# EAGLE design bioamplifierarduinoCMS (EAGLE 7.7.0)
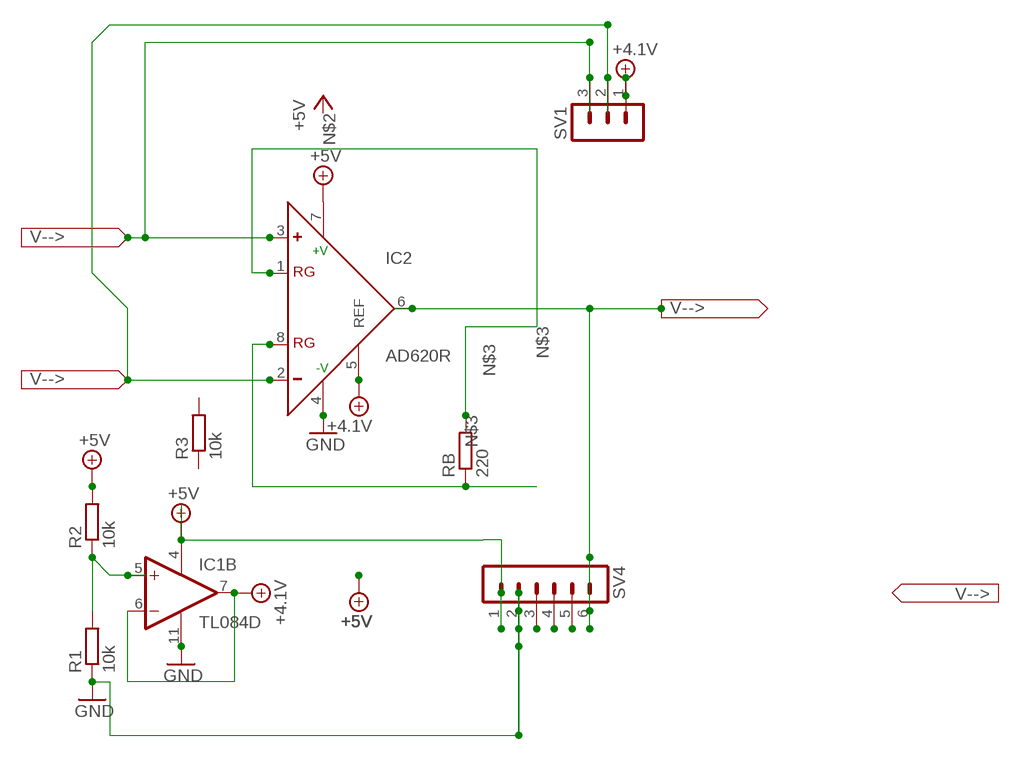
[diagram p0: schematic, sheet 1]

## Parts
IC1  TL084D  [SO14]
IC2  AD620R  [SO8]
R1  10k  R-EU_R1206  [R1206]
R2  10k  R-EU_R1206  [R1206]
R3  10k  R-EU_R1206  [R1206]
RB  220  R-EU_R1206  [R1206]
SV1  MA03-1  [MA03-1]
SV4  MA06-1  [MA06-1]

## Nets
+4.1V: IC1.6(B:-IN) IC1.7(B:OUT) IC2.5(REF)
+5V: IC1.4(P:V+) R2.2 SV4.1
GND: IC1.11(P:V-) IC2.4(-V) R1.1 SV4.2
N$1: IC2.3(+) SV1.3
N$2: IC2.7(+V) ; supply symbol labelled +5V
N$3: IC2.1(RG) RB.2
N$4: IC1.5(B:+IN) R1.2 R2.1
N$5: IC2.6(OUT) SV4.6
N$7: SV4.3
N$8: SV4.4
N$9: SV4.5
N$10: IC2.2(-) SV1.2
N$11: IC2.8(RG) RB.1
N$15: SV1.1
Unconnected: IC1.1(A:OUT) IC1.2(A:-IN) IC1.3(A:+IN) IC1.8(C:OUT) IC1.9(C:-IN) IC1.10(C:+IN) IC1.12(D:+IN) IC1.13(D:-IN) IC1.14(D:OUT) R3.1 R3.2

## Library data of the parts
IC1 = linear:TL084: OP AMP
IC2 = analog-devices:AD620: Low Cost, Low Power, Instrumentation Amplifier Source: http://www.analog.com/UploadedFiles/Data_Sheets/37793330023930AD620_e.pdf; MPN: AD620AR; OC_FARNELL: 1464424; OC_NEWARK: 05F7109
R1-R3 RB = resistor:R-EU_: RESISTOR, European symbol
SV1 = con-lstb:MA03-1: PIN HEADER; OC_FARNELL: unknown; OC_NEWARK: unknown
SV4 = con-lstb:MA06-1: PIN HEADER; OC_FARNELL: unknown; OC_NEWARK: unknown

## Board
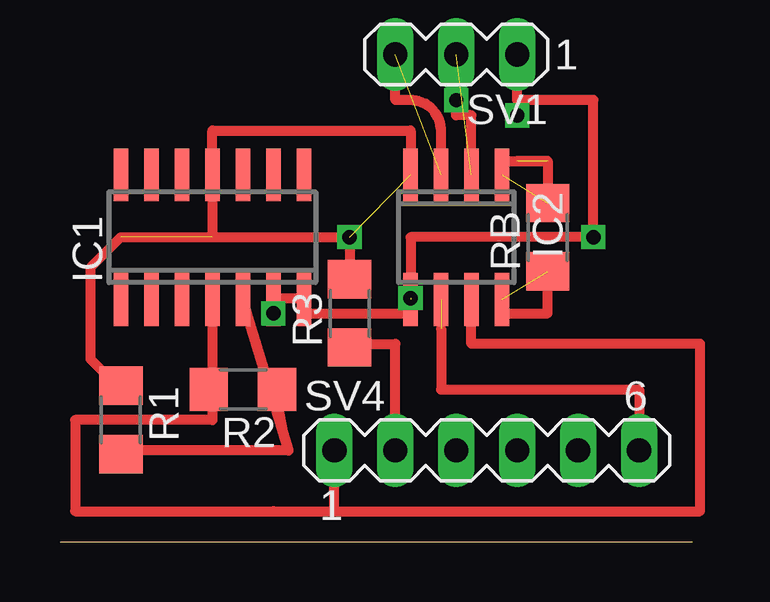
[diagram p1: board, top side]
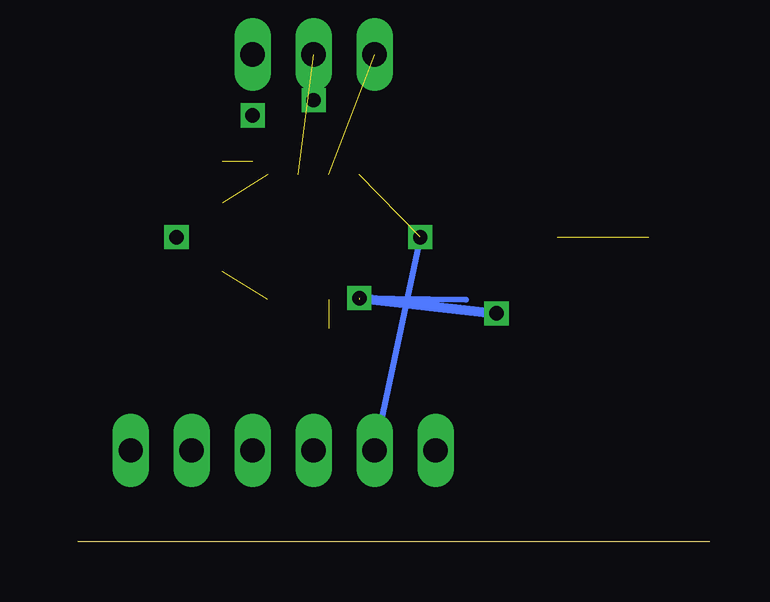
[diagram p2: board, bottom side, seen from below]

Size 26.34 x 0 mm. Coordinates in mm from the lower left corner, seen from the top.
Outline: 0,0 26.34,0
Copper layers (1*16): Top 0.035mm / dielectric 1.5mm / Bottom 0.035mm
Design rules "default": minimum track width 10mil, minimum drill 24mil, track to track 8mil, track to pad 8mil, pad to pad 8mil, via to via 8mil, smd to smd 8mil, copper to edge 40mil, drill to drill 8mil, minimum pad ring 10mil, minimum via ring 8mil, stop-mask expansion 4mil, vias tented up to drill 0mil, thermal gap 10mil

### Footprints (pad centres in the part's own frame; a part is rotated, then mirrored left to right if it is on the bottom)
SO14 = smd 0.6 x 2.2: 1 -3.81,-2.6; 2 -2.54,-2.6; 3 -1.27,-2.6; 4 0,-2.6; 5 1.27,-2.6; 6 2.54,-2.6; 7 3.81,-2.6; 8 3.81,2.6; 9 2.54,2.6; 10 1.27,2.6; 11 0,2.6; 12 -1.27,2.6; 13 -2.54,2.6; 14 -3.81,2.6
SO8 = smd 0.6 x 2.2: 1 -1.905,-2.6; 2 -0.635,-2.6; 3 0.635,-2.6; 4 1.905,-2.6; 5 1.905,2.6; 6 0.635,2.6; 7 -0.635,2.6; 8 -1.905,2.6
R1206 = smd 1.6 x 1.803: 1 -1.422,0; 2 1.422,0
MA03-1 = drill 1.016 long: 1 -2.54,0; 2 0,0; 3 2.54,0
MA06-1 = drill 1.016 long: 1 -6.35,0; 2 -3.81,0; 3 -1.27,0; 4 1.27,0; 5 3.81,0; 6 6.35,0

### Placement (x,y rotation side)
IC1  6.35,12.7 0 top  (outside the outline)
IC2  16.51,12.7 180 top  (outside the outline)
R1  2.54,5.08 270 top  (outside the outline)
R2  7.62,6.35 180 top  (outside the outline)
R3  12.06,9.53 90 top  (outside the outline)
RB  20.32,12.7 90 top  (outside the outline)
SV1  16.51,20.32 180 top  (outside the outline)
SV4  17.78,3.81 0 top  (outside the outline)

### Tracks (layer width: path | path; a pad name or v marks a point on that pad's centre or on a via)
+4.1V  (via drill 0.6)  (2 unrouted)
  Top 0.254: v8.89,9.53 IC1.6
  Top 0.406: v14.61,10.16 14.61,12.7 v22.22,12.7
  Bottom 0.254: v14.61,10.16 IC1.7
  Bottom 0.406: v14.61,10.16 v8.89,9.53
+5V
  Top 0.254: 6.35,10.16 IC1.4 | 6.35,6.35 R2.2
  Top 0.406: IC1.4 6.35,6.35 6.35,5.08 0.64,5.08 0.64,1.27 11.43,1.27 SV4.1
GND  (via drill 0.6)  (2 unrouted)
  Top 0.254: 2.54,6.35 R1.1
  Top 0.406: 2.54,6.35 1.27,7.62 1.27,11.43 2.54,12.7 6.35,12.7 | IC1.11 6.35,12.7 | 6.35,12.7 v12.06,12.7 12.06,10.8
  Bottom 0.254: v12.06,12.7 SV4.2
N$1  (1 unrouted)
N$3  (1 unrouted)
N$4
  Top 0.254: 2.54,3.81 R1.2 | 9.52,3.81 R2.1 | 7.62,10.16 IC1.5
  Top 0.406: 2.54,3.81 9.52,3.81 IC1.5
N$5  (1 unrouted)
  Top 0.406: 15.88,8.89 15.88,6.35 24.13,6.35 SV4.6
N$6  (1 unrouted)
  Top 0.406: 20.32,13.97 20.32,15.88 19.05,15.88
N$10  (1 unrouted)
N$11  (1 unrouted)
N$12
  Top 0.406: 10.16,9.53 14.61,9.53
N$13
  Top 0.406: 18.41,9.53 20.32,9.53 20.32,11.43
N$14
  Top 0.406: 18.41,15.88 20.32,15.88
N$16
  Top 0.406: 13.97,5.08 13.97,8.26 12.06,8.26
N$17
  Top 0.406: 8.89,10.16 10.16,10.16
N$18  (via drill 0.6)
  other vias: 19.05,17.78
N$19  (via drill 0.6)
  other vias: 16.51,18.42
N$20
  Top 0.406: 22.22,12.7 22.22,18.42 19.05,18.42 19.05,19.69
N$21
  Top 0.406: 17.14,15.88 17.14,17.78 16.51,17.78 16.51,19.69
N$22
  Top 0.406: 15.88,15.88 15.88,17.14 arc90 14.61,18.42 13.97,18.42 13.97,19.05
N$23
  Top 0.406: 6.35,15.88 6.35,17.14 14.61,17.14 14.61,15.88
N$24
  Top 0.406: 8.89,1.27 26.67,1.27 26.67,8.26 17.14,8.26 17.14,9.53